# EAGLE design VC_APC_v.00 (EAGLE 6.5.0)
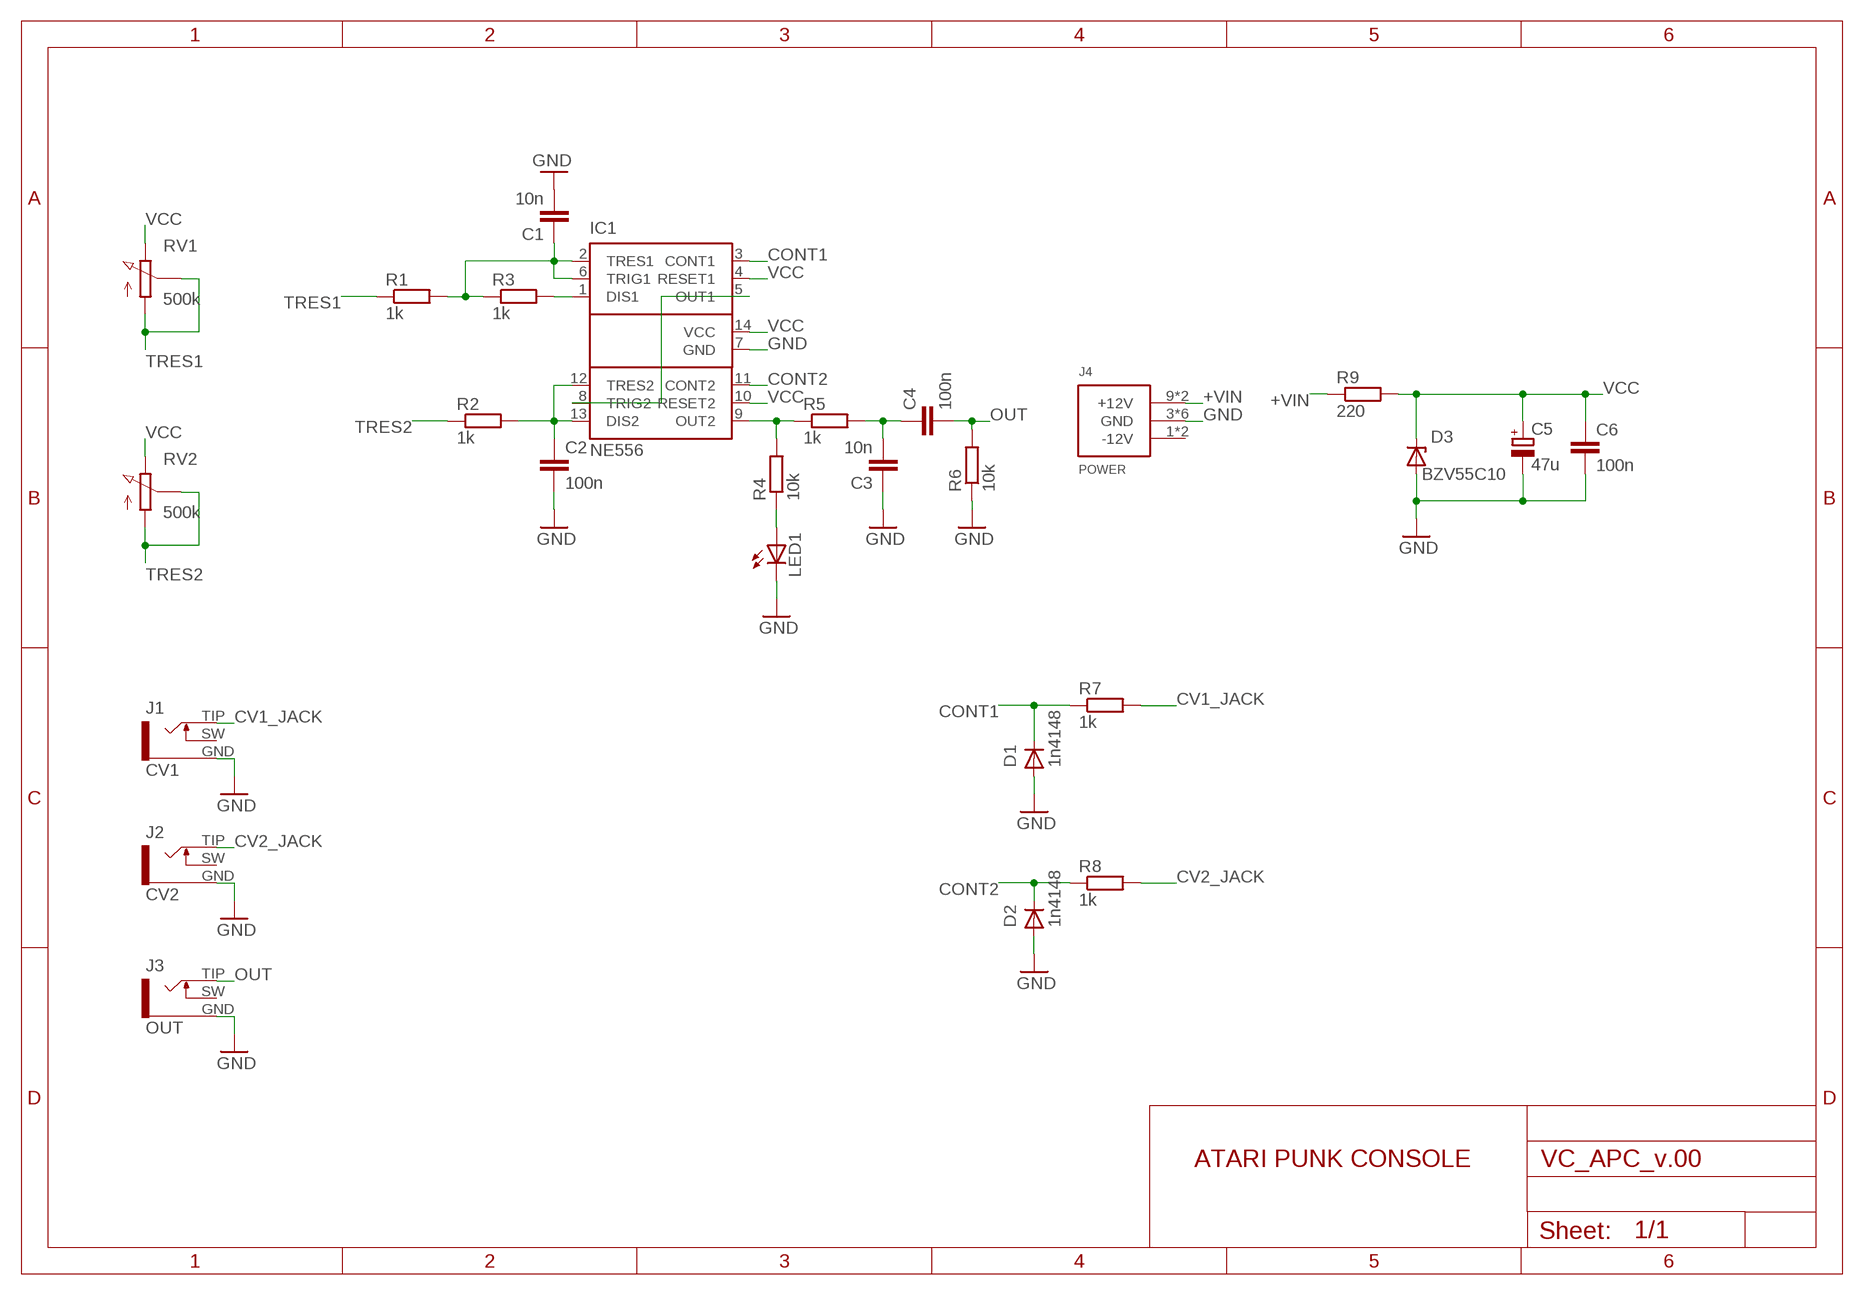
[diagram p0: schematic, sheet 1]

## Parts
C1  10n  C-EU050-025X075  [C050-025X075]
C2  100n  C-EU050-025X075  [C050-025X075]
C3  10n  C-EU050-025X075  [C050-025X075]
C4  100n  C-EU050-025X075  [C050-025X075]
C5  47u  CPOL-EUE2.5-6  [E2,5-6]
C6  100n  C-EU050-025X075  [C050-025X075]
D1  1n4148  1N4148DO35-7  [DO35-7]
D2  1n4148  1N4148DO35-7  [DO35-7]
D3  BZV55C10  ZENERDO35  [DO35-7@1]
IC1  NE556  [DIL14]
J1  CV1  JACK_MONOSWH  [WQP-PJ302M]
J2  CV2  JACK_MONOSWH  [WQP-PJ302M]
J3  OUT  JACK_MONOSWH  [WQP-PJ302M]
J4  POWER  POWER_SIMPLEM  [POWER_10M]
LED1  LED3MM  [LED3MM]
R1  1k  R-EU_0204/7  [0204/7]
R2  1k  R-EU_0204/7  [0204/7]
R3  1k  R-EU_0204/7  [0204/7]
R4  10k  R-EU_0204/7  [0204/7]
R5  1k  R-EU_0204/7  [0204/7]
R6  10k  R-EU_0204/7  [0204/7]
R7  1k  R-EU_0204/7  [0204/7]
R8  1k  R-EU_0204/7  [0204/7]
R9  220  R-EU_0204/7  [0204/7]
RV1  500k  POT_C  [POT_COMBO]
RV2  500k  POT_C  [POT_COMBO]

## Nets
+VIN: J4.9(+12V) J4.10(+12V) R9.1
CONT1: D1.C IC1.3(CONT1) R7.1
CONT2: D2.C IC1.11(CONT2) R8.1
CV1_JACK: J1.TIP R7.2
CV2_JACK: J2.TIP R8.2
DIS1: IC1.1(DIS1) R3.2
GND: C1.2 C2.2 C3.1 C5.- C6.2 D1.A D2.A D3.A IC1.7(GND) J1.GND J2.GND J3.GND J4.3(GND) J4.4(GND) J4.5(GND) J4.6(GND) J4.7(GND) J4.8(GND) LED1.K(C) R6.1
N$1: LED1.A R4.1
OUT: C4.2 J3.TIP R6.2
OUT1: IC1.5(OUT1) IC1.8(TRIG2)
OUT_: IC1.9(OUT2) R4.2 R5.1
OUT_LP: C3.2 C4.1 R5.2
TRES1: R1.1 RV1.1 RV1.1A RV1.2
TRES1_: C1.1 IC1.2(TRES1) IC1.6(TRIG1) R1.2 R3.1
TRES2: R2.1 RV2.1 RV2.1A RV2.2
TRES2_: C2.1 IC1.12(TRES2) IC1.13(DIS2) R2.2
VCC: C5.+ C6.1 D3.C IC1.4(RESET1) IC1.10(RESET2) IC1.14(VCC) R9.2 RV1.3 RV1.3A RV2.3 RV2.3A
Unconnected: J1.SW J2.SW J3.SW J4.1(-12V) J4.2(-12V)

## Notes on the sheet
- ATARI PUNK CONSOLE

## Library data of the parts
C1-C4 C6 = rcl:C-EU: CAPACITOR, European symbol
C5 = rcl:CPOL-EU: POLARIZED CAPACITOR, European symbol
D1 D2 = _motovilo:1N4148: DIODE high speed (Philips)
D3 = _motovilo:ZENER: ZENER DIODE
IC1 = _mtvl_ic:NE556: General Purpose Biopolartimer; MPN: NE556; OC_FARNELL: 2349784; OC_NEWARK: 83C0108
J1-J3 = _mtvl.connectors:JACK_MONOSW
J4 = _mtvl.connectors:POWER_SIMPLE
LED1 = _mtvt.led:LED
R1-R9 = rcl:R-EU_: RESISTOR, European symbol
RV1 RV2 = _motovilo:POT_: POT one level

## Board
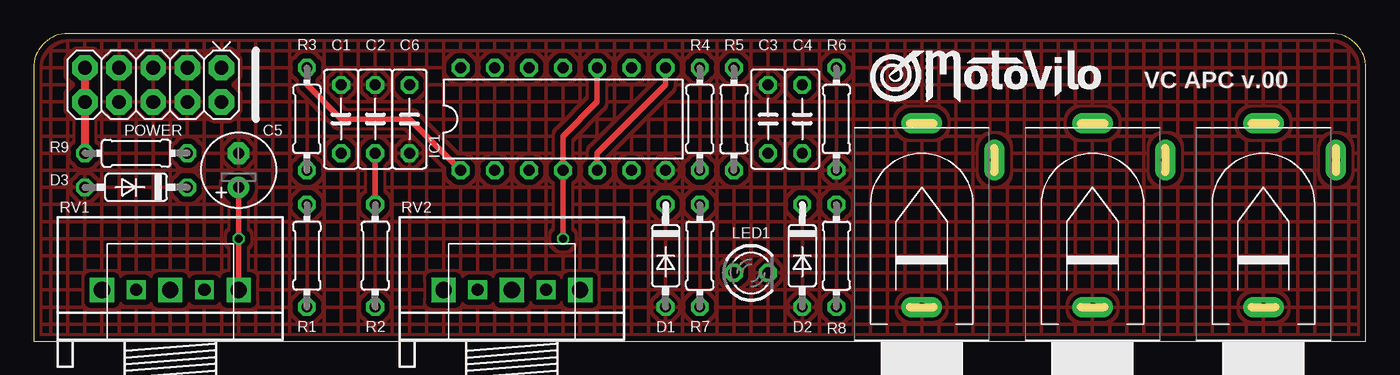
[diagram p1: board, top side]
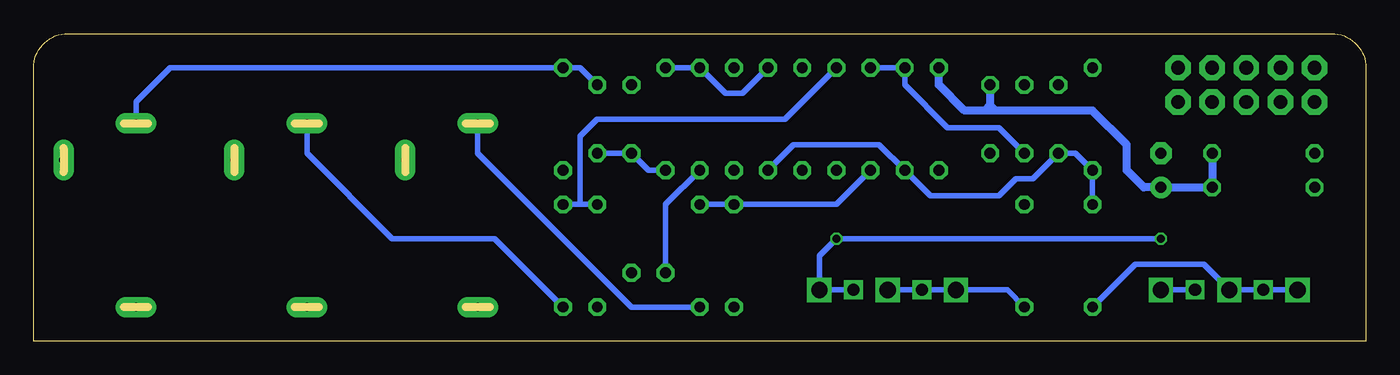
[diagram p2: board, bottom side, seen from below]

Size 99.06 x 22.86 mm. Coordinates in mm from the lower left corner, seen from the top.
Outline: 0,0 99.06,0 99.06,20.32 arc90 96.52,22.86 2.54,22.86 arc90 0,20.32 0,0
Copper layers (1*16): Top 0.035mm / dielectric 1.5mm / Bottom 0.035mm
Design rules "Motovilo Design Rules #1": minimum track width 10mil, minimum drill 12mil, track to track 10mil, track to pad 10mil, pad to pad 10mil, via to via 10mil, smd to smd 0mil, copper to edge 16mil, drill to drill 25mil, minimum pad ring 10mil, minimum via ring 6mil, stop-mask expansion 2mil, vias tented up to drill 100mil, thermal gap 10mil

### Footprints (pad centres in the part's own frame; a part is rotated, then mirrored left to right if it is on the bottom)
C050-025X075 = drill 0.813 octagon: 1 -2.54,0; 2 2.54,0
E2,5-6 = drill 0.813 pad 1.6: + -1.27,0 | drill 0.813 pad 1.6 octagon: - 1.27,0
DO35-7 = drill 0.813 octagon: A 3.81,0; C -3.81,0
DO35-7@1 = drill 0.813 octagon: A 3.81,0; C -3.81,0
DIL14 = drill 0.813 octagon: 1 -7.62,-3.81; 2 -5.08,-3.81; 3 -2.54,-3.81; 4 0,-3.81; 5 2.54,-3.81; 6 5.08,-3.81; 7 7.62,-3.81; 8 7.62,3.81; 9 5.08,3.81; 10 2.54,3.81; 11 0,3.81; 12 -2.54,3.81; 13 -5.08,3.81; 14 -7.62,3.81
WQP-PJ302M = drill 0.61 pad 1.524 long: GND 0,-5.08; SW 5.397,5.842; TIP 0,8.572
POWER_10M = drill 1.016 pad 1.88 octagon: 1 1.27,-5.08; 2 -1.27,-5.08; 3 1.27,-2.54; 4 -1.27,-2.54; 5 1.27,0; 6 -1.27,0; 7 1.27,2.54; 8 -1.27,2.54; 9 1.27,5.08; 10 -1.27,5.08
LED3MM = drill 0.813 octagon: A -1.27,0; K 1.27,0
0204/7 = drill 0.813 octagon: 1 -3.81,0; 2 3.81,0
POT_COMBO = drill 1.2 square: 1 -5.08,0; 2 0,0; 3 5.08,0 | drill 0.9 square: 1A -2.54,0; 3A 2.54,0

### Placement (x,y rotation side)
C1  22.86,16.51 90 top
C2  25.4,16.51 90 top
C3  54.61,16.51 270 top
C4  57.15,16.51 90 top
C5  15.24,12.7 90 top
C6  27.94,16.51 270 top
D1  46.99,6.35 270 top
D2  57.15,6.35 270 top
D3  7.62,11.43 180 top
IC1  39.37,16.51 0 top
J1  66.04,7.62 0 top
J2  78.74,7.62 0 top
J3  91.44,7.62 0 top
J4  8.89,19.05 90 top
LED1  53.34,5.08 0 top
R1  20.32,6.35 90 top
R2  25.4,6.35 90 top
R3  20.32,16.51 90 top
R4  49.53,16.51 90 top
R5  52.07,16.51 270 top
R6  59.69,16.51 90 top
R7  49.53,6.35 270 top
R8  59.69,6.35 270 top
R9  7.62,13.97 0 top
RV1  10.16,3.81 0 top
RV2  35.56,3.81 0 top
U$1  [LOGO_SPACE_002]  62.23,17.78 0 top

### Tracks (layer width: path | path; a pad name or v marks a point on that pad's centre or on a via)
+VIN
  Top 0.61: J4.9 J4.10 R9.1
CONT1
  Bottom 0.406: R7.1 D1.C 39.37,10.16 IC1.3
CONT2
  Bottom 0.406: R8.1 58.42,10.16 | 58.42,10.16 D2.C | 58.42,10.16 58.42,15.24 57.15,16.51 43.18,16.51 IC1.11
CV1_JACK
  Bottom 0.406: R7.2 54.61,2.54 66.04,13.97 J1.TIP
CV2_JACK
  Bottom 0.406: J2.TIP 78.74,13.97 72.39,7.62 64.77,7.62 R8.2
DIS1
  Top 0.406: IC1.1 27.94,16.51 22.86,16.51 20.32,19.05 R3.2
GND
  pour Top (isolate 0.406, hatched): 0,0 0,22.86 99.06,22.86 99.06,0
N$1
  Bottom 0.406: LED1.A 52.07,10.16 R4.1
OUT
  Bottom 0.406: J3.TIP 91.44,17.78 88.9,20.32 R6.2 58.42,20.32 C4.2
OUT1
  Top 0.406: IC1.8 46.99,19.05 41.91,13.97 IC1.5
OUT_
  Bottom 0.406: R5.1 R4.2 47.62,18.41 46.35,18.41 IC1.9
OUT_LP
  Bottom 0.406: R5.2 53.34,12.7 C3.2 C4.1
TRES1
  Bottom 0.406: RV1.1 RV1.1A RV1.2 12.06,5.71 17.14,5.71 R1.1
TRES1_
  Bottom 0.406: R1.2 R3.1 21.59,13.97 C1.1 24.77,12.06 26.04,12.06 27.3,10.79 32.38,10.79 IC1.2 36.2,14.61 42.55,14.61 IC1.6
TRES2
  Bottom 0.406: RV2.2 RV2.1A RV2.1 26.67,3.81 R2.1
TRES2_
  Top 0.406: R2.2 C2.1
  Bottom 0.406: IC1.12 IC1.13 34.29,19.05 31.11,15.88 27.3,15.88 C2.1
VCC  (via drill 0.6)
  Top 0.406: RV1.3 v15.24,7.62 C5.+ | v39.37,7.62 IC1.4 39.37,15.24 41.91,17.78 IC1.10
  Bottom 0.254: 27.3,17.14 27.94,17.78 28.57,17.14
  Bottom 0.406: v15.24,7.62 v39.37,7.62 40.64,6.35 RV2.3 RV2.3A | RV1.3A RV1.3
  Bottom 0.61: 27.94,17.14 27.3,17.14 20.32,17.14 17.78,14.61 17.78,12.7 16.51,11.43 C5.+ D3.C R9.2 | 27.94,17.14 28.57,17.14 29.84,17.14 31.75,19.05 IC1.14 | C6.1 27.94,17.78 27.94,17.14

### Text on the board
tPlace: VC APC v.00